# Altium schematic sheet Sheet.SchDoc_2022-03-31.schdoc
size 268 x 180 mm
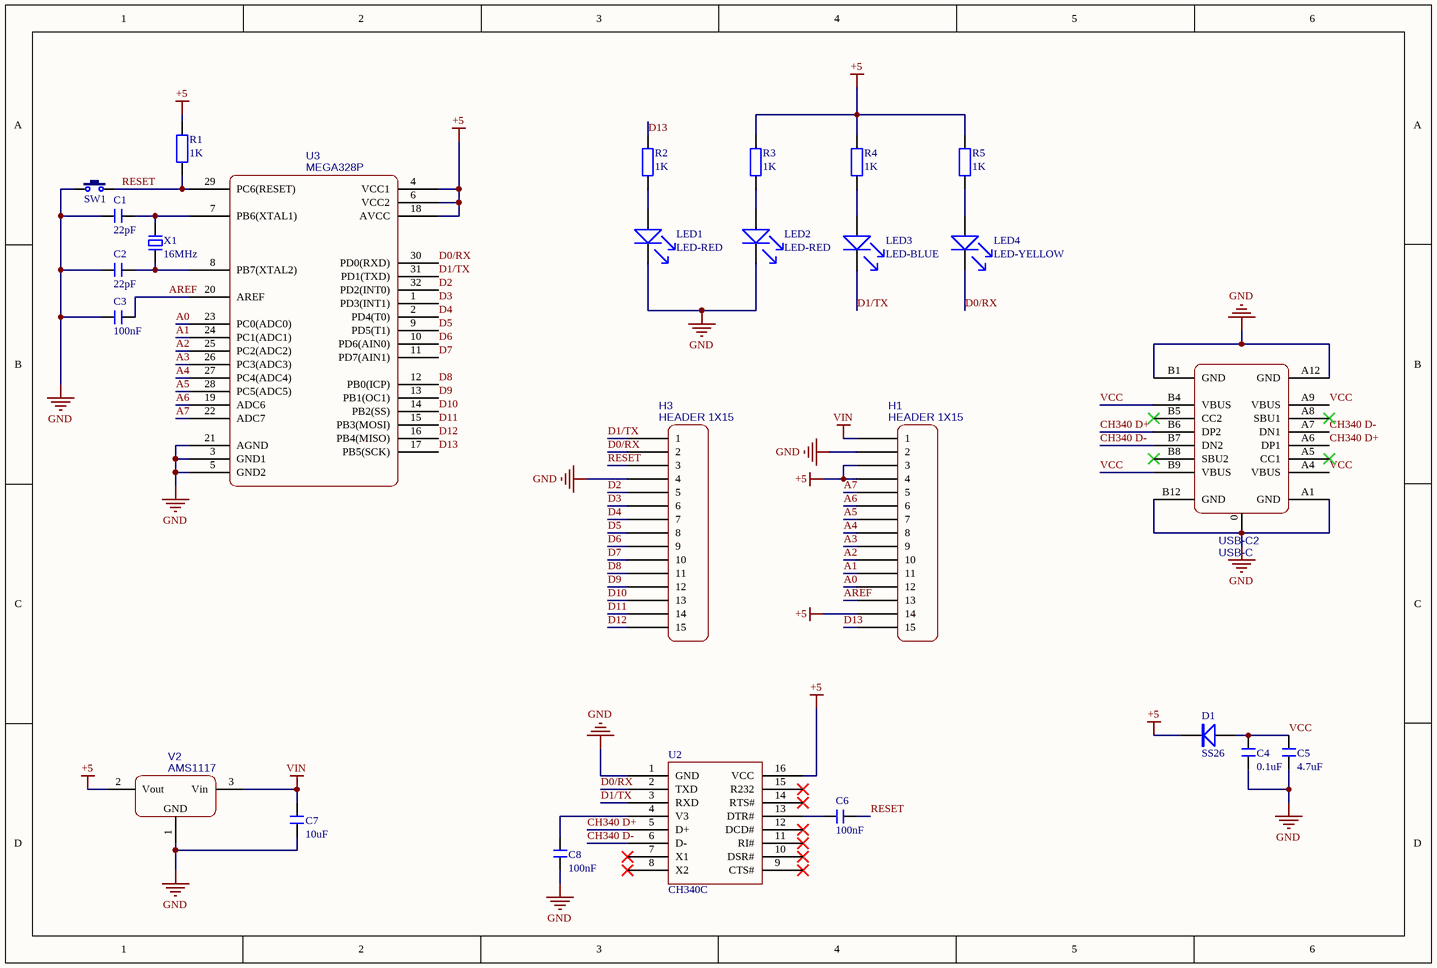
[diagram p0: Sheet.SchDoc_2022-03-31.schdoc]

## Parts
C1  22pF  [C 0603_L]
C2  22pF  [C 0603_L]
C3  100nF  [C 0603_L]
C4  0.1uF  [C 0603_L]
C5  4.7uF  [C 0603_L]
C6  100nF  [C 0603_L]
C7  10uF  [C 1206_L]
C8  100nF  [C 0603_L]
D1  SS26  [SOD-123]
H1  HEADER 1X15  [HDR2.54-LI-15P]
H3  HEADER 1X15  [HDR2.54-LI-15P]
LED1  LED-RED  [LED 0805]
LED2  LED-RED  [LED 0805]
LED3  LED-BLUE  [LED 0805B]
LED4  LED-YELLOW  [LED 0805Y]
R1  1K  [R 0603_L]
R2  1K  [R 0603_L]
R3  1K  [R 0603_L]
R4  1K  [R 0603_L]
R5  1K  [R 0603_L]
SW1  3x6x5  [TSW SMD-3*6*2.5]  (value not drawn)
U2  CH340C  [SOP16_L]
U3  MEGA328P  [TQFP32-7*7]
USB-C2  USB-C  [TYPE-C-USB-5]
V2  AMS1117  [AMS1117]
X1  16MHz  [OSC 5032-2P]

## Nets
+5: D1.2(K) H1.3 H1.4 H1.14 R1.2 R3.2 R4.2 R5.2 U2.16(VCC) U3.4(VCC1) U3.6(VCC2) U3.18(AVCC) V2.2(Vout)
GND: C1.1 C2.1 C3.1 C4.1 C5.1 C7.1 C8.1 H1.2 H3.4 LED1.2 LED2.2 SW1.1 U2.1(GND) U3.3(GND1) U3.5(GND2) U3.21(AGND) USB-C2.A1(GND) USB-C2.A12(GND) USB-C2.B1(GND) USB-C2.B12(GND) V2.1(GND)
VIN: C7.2 H1.1 V2.3(Vin)
A0: H1.12 U3.23(PC0(ADC0))
A1: H1.11 U3.24(PC1(ADC1))
A2: H1.10 U3.25(PC2(ADC2))
A3: H1.9 U3.26(PC3(ADC3))
A4: H1.8 U3.27(PC4(ADC4))
A5: H1.7 U3.28(PC5(ADC5))
A6: H1.6 U3.19(ADC6)
A7: H1.5 U3.22(ADC7)
AREF: C3.2 H1.13 U3.20(AREF)
CH340 D+: U2.5(D+) USB-C2.A6(DP1) USB-C2.B6(DP2)
CH340 D-: U2.6(D-) USB-C2.A7(DN1) USB-C2.B7(DN2)
D0/RX: H3.2 LED4.2 U2.2(TXD) U3.30(PD0(RXD))
D1/TX: H3.1 LED3.2 U2.3(RXD) U3.31(PD1(TXD))
D2: H3.5 U3.32(PD2(INT0))
D3: H3.6 U3.1(PD3(INT1))
D4: H3.7 U3.2(PD4(T0))
D5: H3.8 U3.9(PD5(T1))
D6: H3.9 U3.10(PD6(AIN0))
D7: H3.10 U3.11(PD7(AIN1))
D8: H3.11 U3.12(PB0(ICP))
D9: H3.12 U3.13(PB1(OC1))
D10: H3.13 U3.14(PB2(SS))
D11: H3.14 U3.15(PB3(MOSI))
D12: H3.15 U3.16(PB4(MISO))
D13: H1.15 R2.2 U3.17(PB5(SCK))
RESET: C6.1 H3.3 R1.1 SW1.2 U3.29(PC6(RESET))
VCC: C4.2 C5.2 D1.1(A) USB-C2.A4(VBUS) USB-C2.A9(VBUS) USB-C2.B4(VBUS) USB-C2.B9(VBUS)
NetC1_2: C1.2 U3.7(PB6(XTAL1)) X1.2
NetC2_2: C2.2 U3.8(PB7(XTAL2)) X1.1
NetC6_2: C6.2 U2.13(DTR#)
NetC8_2: C8.2 U2.4(V3)
NetLED1_1: LED1.1 R2.1
NetLED2_1: LED2.1 R3.1
NetLED3_1: LED3.1 R4.1
NetLED4_1: LED4.1 R5.1

Not connected (* = marked no-connect by the designer): U2 7(X1)* 8(X2)* 9(CTS#)* 10(DSR#)* 11(RI#)* 12(DCD#)* 14(RTS#)* 15(R232)*; USB-C2 0 A5(CC1)* A8(SBU1)* B5(CC2)* B8(SBU2)*

## Library data of the parts
C1 C2 = 22pF: BOM名称: 无极性贴片电容
C3 C6 C8 = 100nF: BOM名称: 无极性贴片电容
C4 = 0.1uF: BOM名称: 无极性贴片电容
C5 = 4.7uF: BOM名称: 无极性贴片电容
C7 = 10uF: BOM名称: 无极性贴片电容
D1 = SS26: BOM名称: 整流二极管
H1 H3 = HEADER 1X15: Contributor: Aknice; spicePre: H; spiceSymbolName: HEADER 1X15
R1-R5 = 1K: BOM名称: 贴片电阻
SW1 = 3x6x5: BOM名称: 3x6轻触开关
U3 = MEGA328P: Contributor: Aknice; spicePre: U; spiceSymbolName: MEGA328P
USB-C2 = USB-C: Contributor: Aknice; spicePre: U; spiceSymbolName: USB-C
V2 = AMS1117: BOM名称: 稳压芯片; Contributor: Aknice; spicePre: V; spiceSymbolName: AMS1117
X1 = 16MHz: BOM名称: 2脚无源脚晶振